# Altium schematic sheet Revisions.SchDoc
size B; DrawnBy: PWS; Engineer: PWS; DocumentNumber: 1; Revision: 1; SheetNumber: 1; SheetTotal: 7
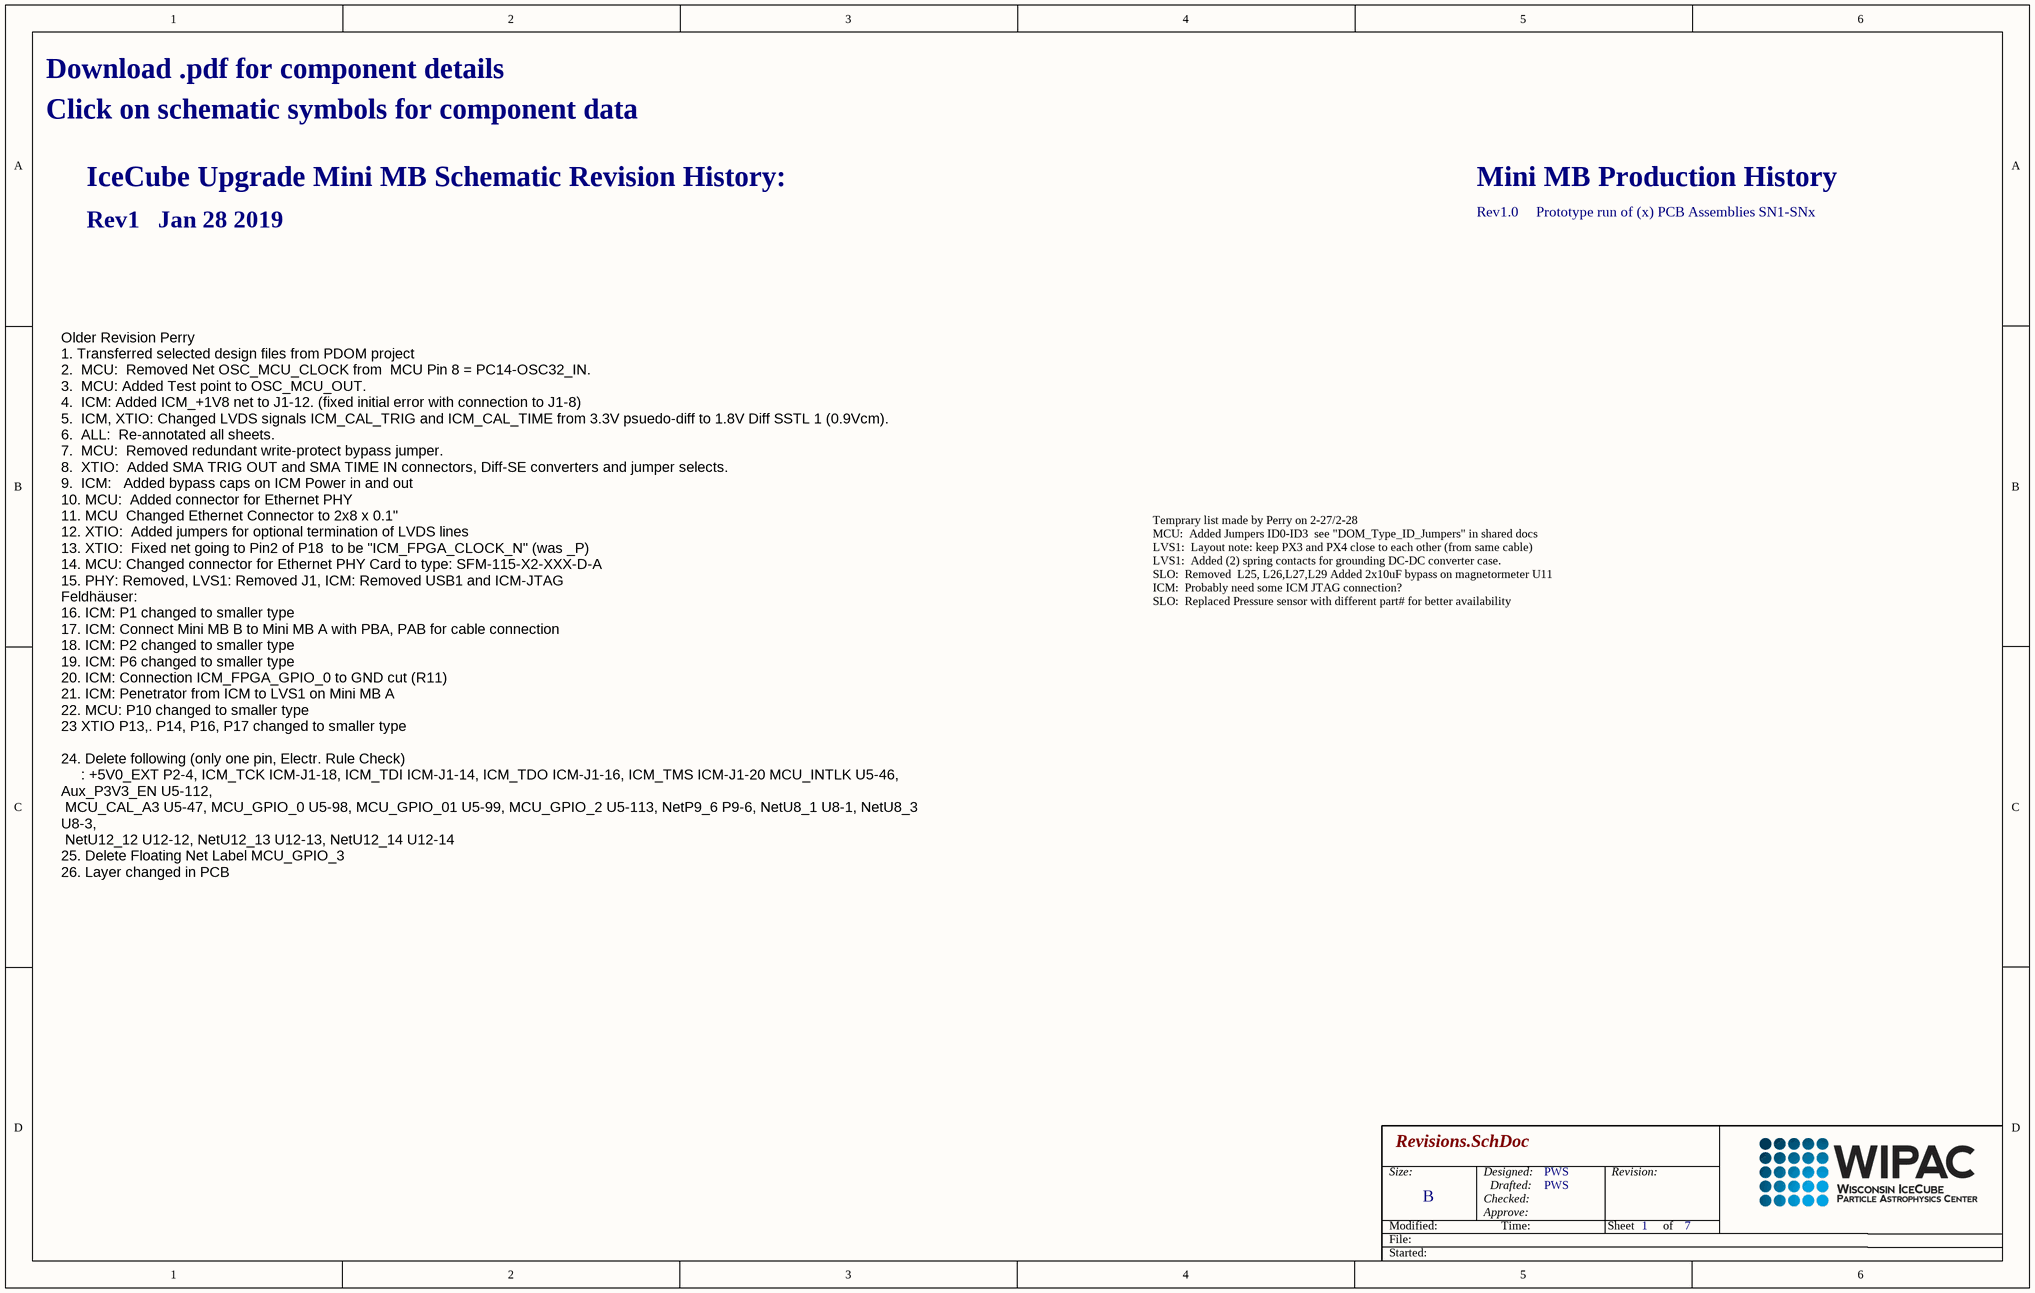
[diagram p0: Revisions.SchDoc]

## Notes on the sheet
- Download .pdf for component details
- Click on schematic symbols for component data
- IceCube Upgrade Mini MB Schematic Revision History:
- Rev1   Jan 28 2019
- Rev1.0     Prototype run of (x) PCB Assemblies SN1-SNx
- Mini MB Production History
- Temprary list made by Perry on 2-27/2-28
  MCU:  Added Jumpers ID0-ID3  see "DOM_Type_ID_Jumpers" in shared docs
  LVS1:  Layout note: keep PX3 and PX4 close to each other (from same cable)
  LVS1:  Added (2) spring contacts for grounding DC-DC converter case.
  SLO:  Removed  L25, L26,L27,L29 Added 2x10uF bypass on magnetormeter U11
  ICM:  Probably need some ICM JTAG connection?
  SLO:  Replaced Pressure sensor with different part# for better availability
- Older Revision Perry
  1. Transferred selected design files from PDOM project
  2.  MCU:  Removed Net OSC_MCU_CLOCK from  MCU Pin 8 = PC14-OSC32_IN.
  3.  MCU: Added Test point to OSC_MCU_OUT.
  4.  ICM: Added ICM_+1V8 net to J1-12. (fixed initial error with connection to J1-8)
  5.  ICM, XTIO: Changed LVDS signals ICM_CAL_TRIG and ICM_CAL_TIME from 3.3V psuedo-diff to 1.8V Diff SSTL 1 (0.9Vcm).
  6.  ALL:  Re-annotated all sheets.
  7.  MCU:  Removed redundant write-protect bypass jumper.
  8.  XTIO:  Added SMA TRIG OUT and SMA TIME IN connectors, Diff-SE converters and jumper selects.
  9.  ICM:   Added bypass caps on ICM Power in and out
  10. MCU:  Added connector for Ethernet PHY
  11. MCU  Changed Ethernet Connector to 2x8 x 0.1"
  12. XTIO:  Added jumpers for optional termination of LVDS lines
  13. XTIO:  Fixed net going to Pin2 of P18  to be "ICM_FPGA_CLOCK_N" (was _P)
  14. MCU: Changed connector for Ethernet PHY Card to type: SFM-115-X2-XXX-D-A
  15. PHY: Removed, LVS1: Removed J1, ICM: Removed USB1 and ICM-JTAG
  Feldhäuser:
  16. ICM: P1 changed to smaller type
  17. ICM: Connect Mini MB B to Mini MB A with PBA, PAB for cable connection
  18. ICM: P2 changed to smaller type
  19. ICM: P6 changed to smaller type
  20. ICM: Connection ICM_FPGA_GPIO_0 to GND cut (R11)
  21. ICM: Penetrator from ICM to LVS1 on Mini MB A
  22. MCU: P10 changed to smaller type
  23 XTIO P13,. P14, P16, P17 changed to smaller type
  24. Delete following (only one pin, Electr. Rule Check)
  : +5V0_EXT P2-4, ICM_TCK ICM-J1-18, ICM_TDI ICM-J1-14, ICM_TDO ICM-J1-16, ICM_TMS ICM-J1-20 MCU_INTLK U5-46, Aux_P3V3_EN U5-112,
  MCU_CAL_A3 U5-47, MCU_GPIO_0 U5-98, MCU_GPIO_01 U5-99, MCU_GPIO_2 U5-113, NetP9_6 P9-6, NetU8_1 U8-1, NetU8_3 U8-3,
  NetU12_12 U12-12, NetU12_13 U12-13, NetU12_14 U12-14
  25. Delete Floating Net Label MCU_GPIO_3
  26. Layer changed in PCB
- Size:
- Designed:
- Revision:
- Modified:
- File:
- B
- Checked:
- Approve:
- Drafted:
- Time:
- Sheet
- of
- Started: